# Altium schematic sheet [4]-MCU_POWER.SchDoc
size A4
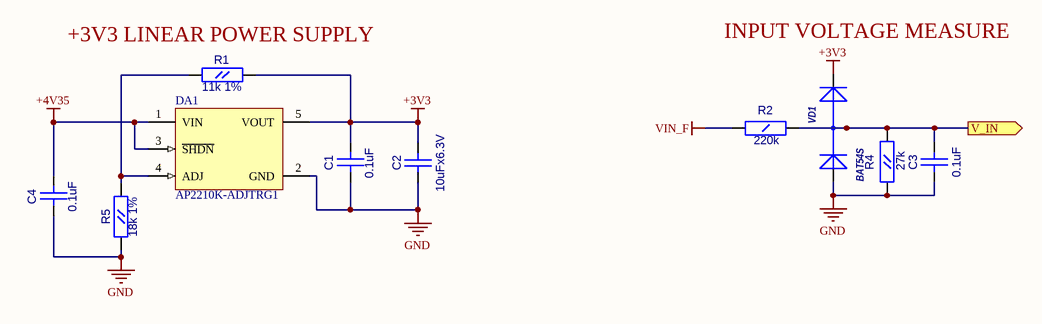
[diagram p0: [4]-MCU_POWER.SchDoc]

## Parts
C1  0.1uF  [CC0603]
C2  10uFx6.3V  [CC0805]
C3  0.1uF  [CC0603]
C4  0.1uF  [CC0603]
DA1  AP2210K-ADJTRG1  [SOT23-5]
R1  11k 1%  [RC0603]
R2  220k  [RC1206]
R4  27k  [RC0603]
R5  18k 1%  [RC0603]
VD1  BAT54S  [SOT-23(GSD)]

## Ports
V_IN (out)

## Nets
+3V3: C1.1(A) C2.2(B) DA1.5(VOUT) R1.2(B) VD1.2(K)
+4V35: C4.1(A) DA1.1(VIN) DA1.3(~{SHDN})
GND: C1.2(B) C2.1(A) C3.1(A) C4.2(B) DA1.2(GND) R4.1(A) R5.1(A) VD1.1(A)
VIN_F: R2.1(A)
V_IN: C3.2(B) R2.2(B) R4.2(B) VD1.3(AK) ; port V_IN
NetDA1_4: DA1.4(ADJ) R1.1(A) R5.2(B)

## Notes on the sheet
- (near R1) +3V3 LINEAR POWER SUPPLY
- (near VD1) INPUT VOLTAGE MEASURE

## Library data of the parts
C1 C3 C4 = CC0603: Value: 0.1uF
C2 = CC0805: Value: 10uFx6.3V
DA1 = MCP1824T-ADJE/OT: 300 mA, Low Voltage, Low Quiescent Current LDO Regulator, 5-Pin SOT-223, Extended Temperature, Tape and Reel; Published: 29-Jan-2009; DatasheetVersion: revA, Aug-2007; PackageVersion: revAW, Oct-2008; PackageReference: SOT-223-DC5; Publisher: Altium Limited; PackageDescription: 5-Lead Plastic Small Outline Transistor (DC) [SOT-223]; ComponentLink1Description: Manufacturer Link; ComponentLink1URL: http://www.microchip.com; ComponentLink2Description: Datasheet; ComponentLink2URL: http://ww1.microchip.com/downloads/en/DeviceDoc/22070a.pdf; ComponentLink3Description: Packaging Specification; ComponentLink3URL: http://ww1.microchip.com/downloads/en/PackagingSpec/00049AW.pdf
R1 R4 R5 = RC0603
  R1: Value: 11k 1%
  R4: Value: 27k
  R5: Value: 18k 1%
R2 = RC1206: Value: 220k
VD1 = BAT54S: 1.0 Ampere General Purpose Rectifier; ComponentField6: Published 8-Jun-2000, Modified 11-July-2000: SIM Model Added.; Value: *